# EAGLE schematic Seeeduino LoRaWan (EAGLE 7.6.0)
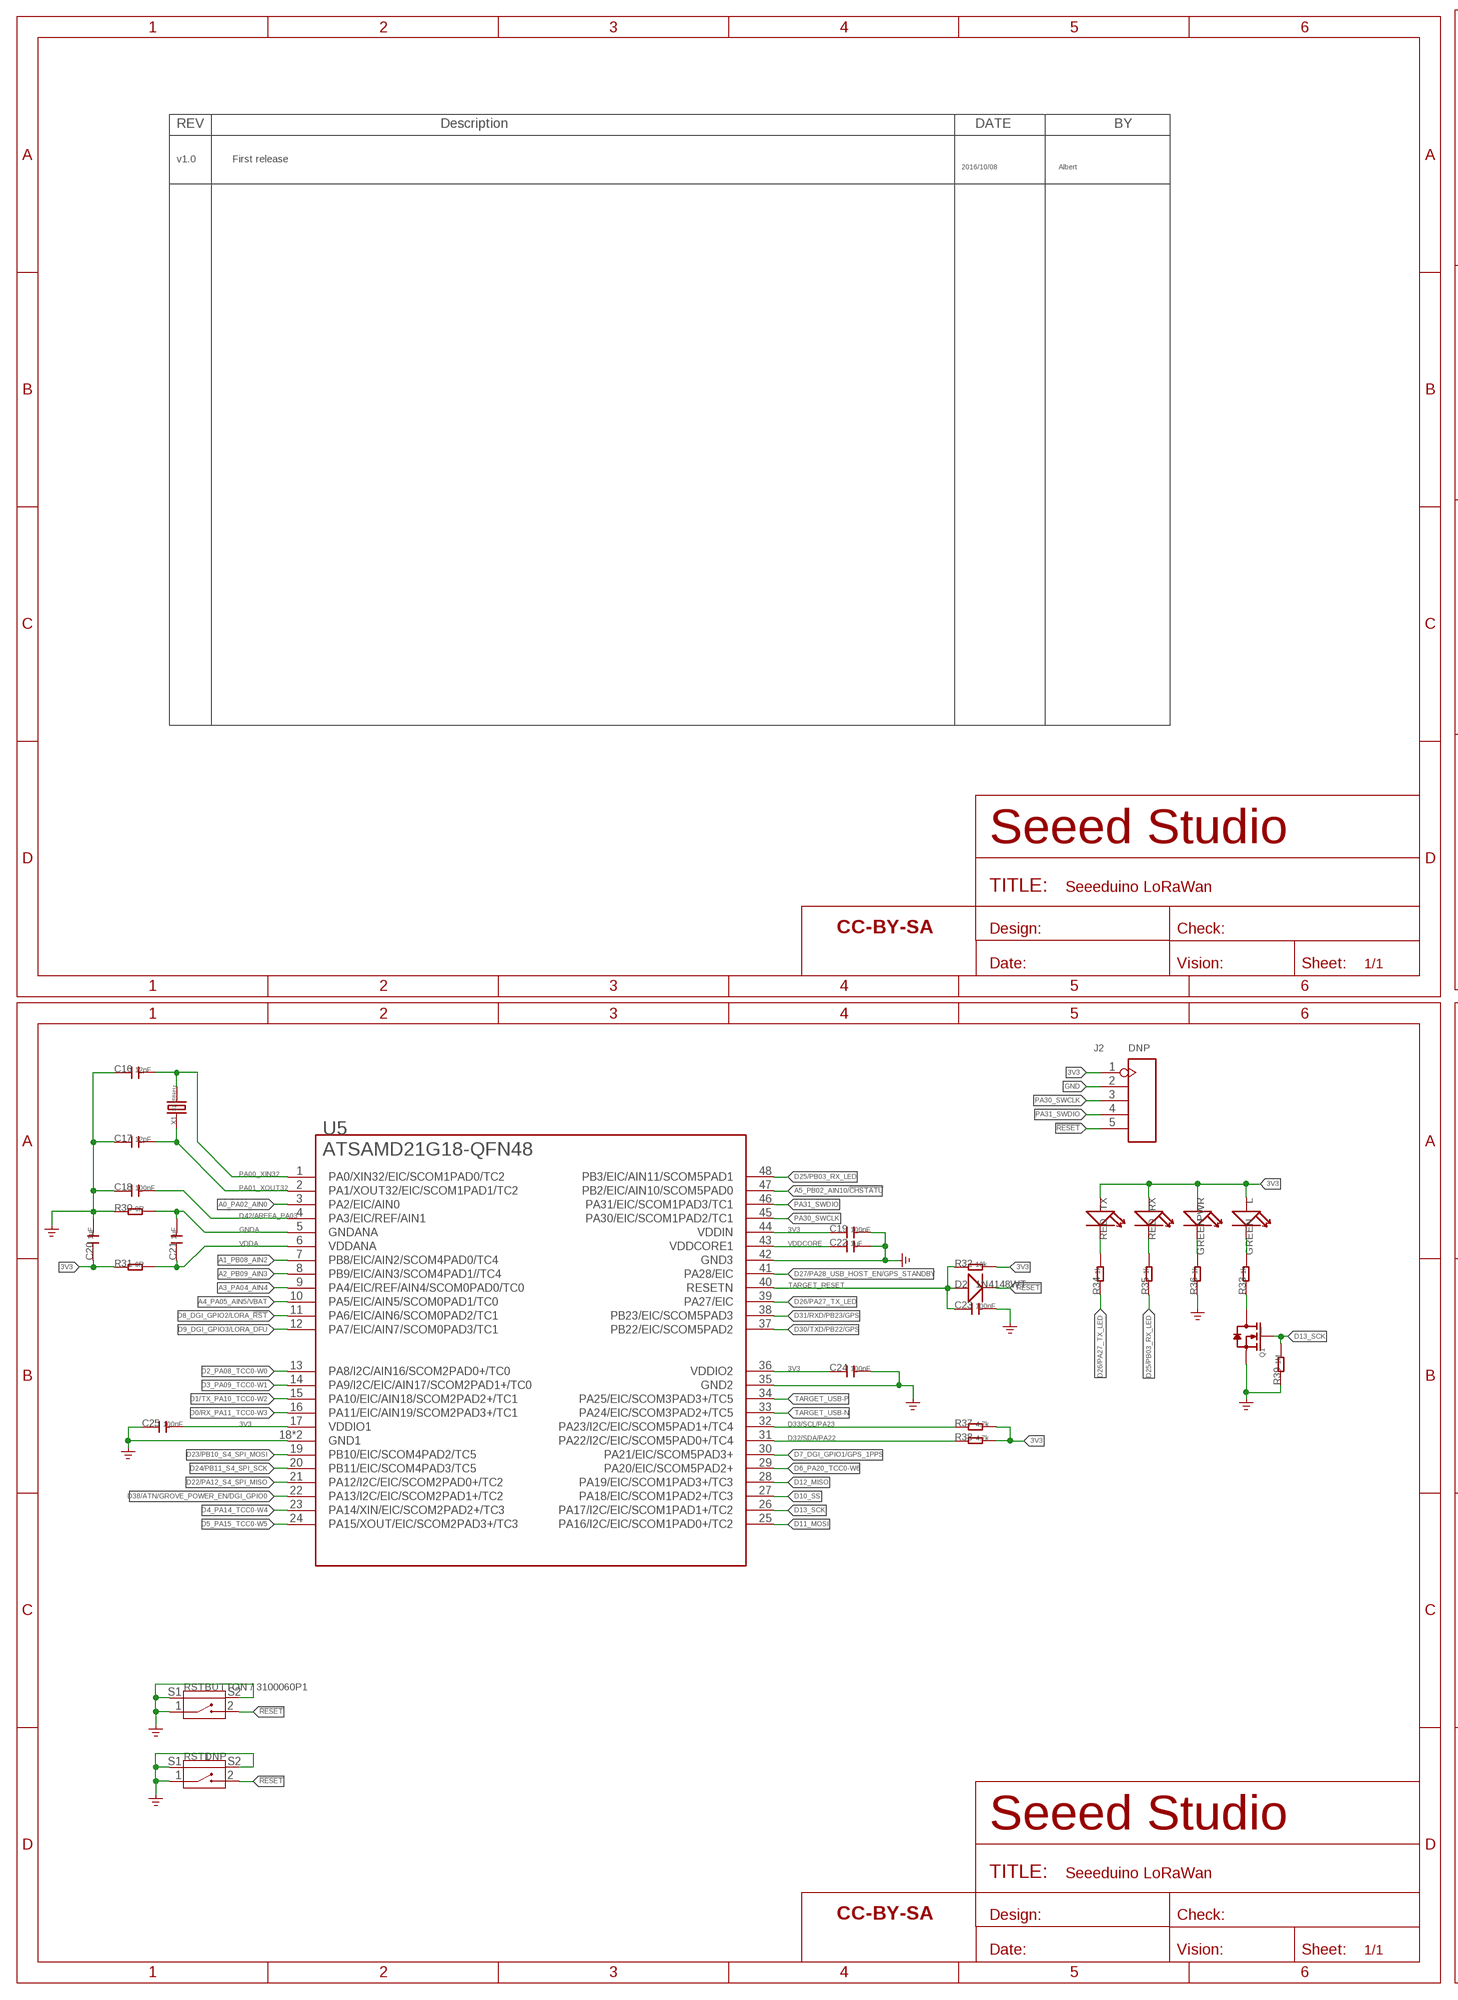
[diagram p0: schematic, sheet 1, part 1 of 2]
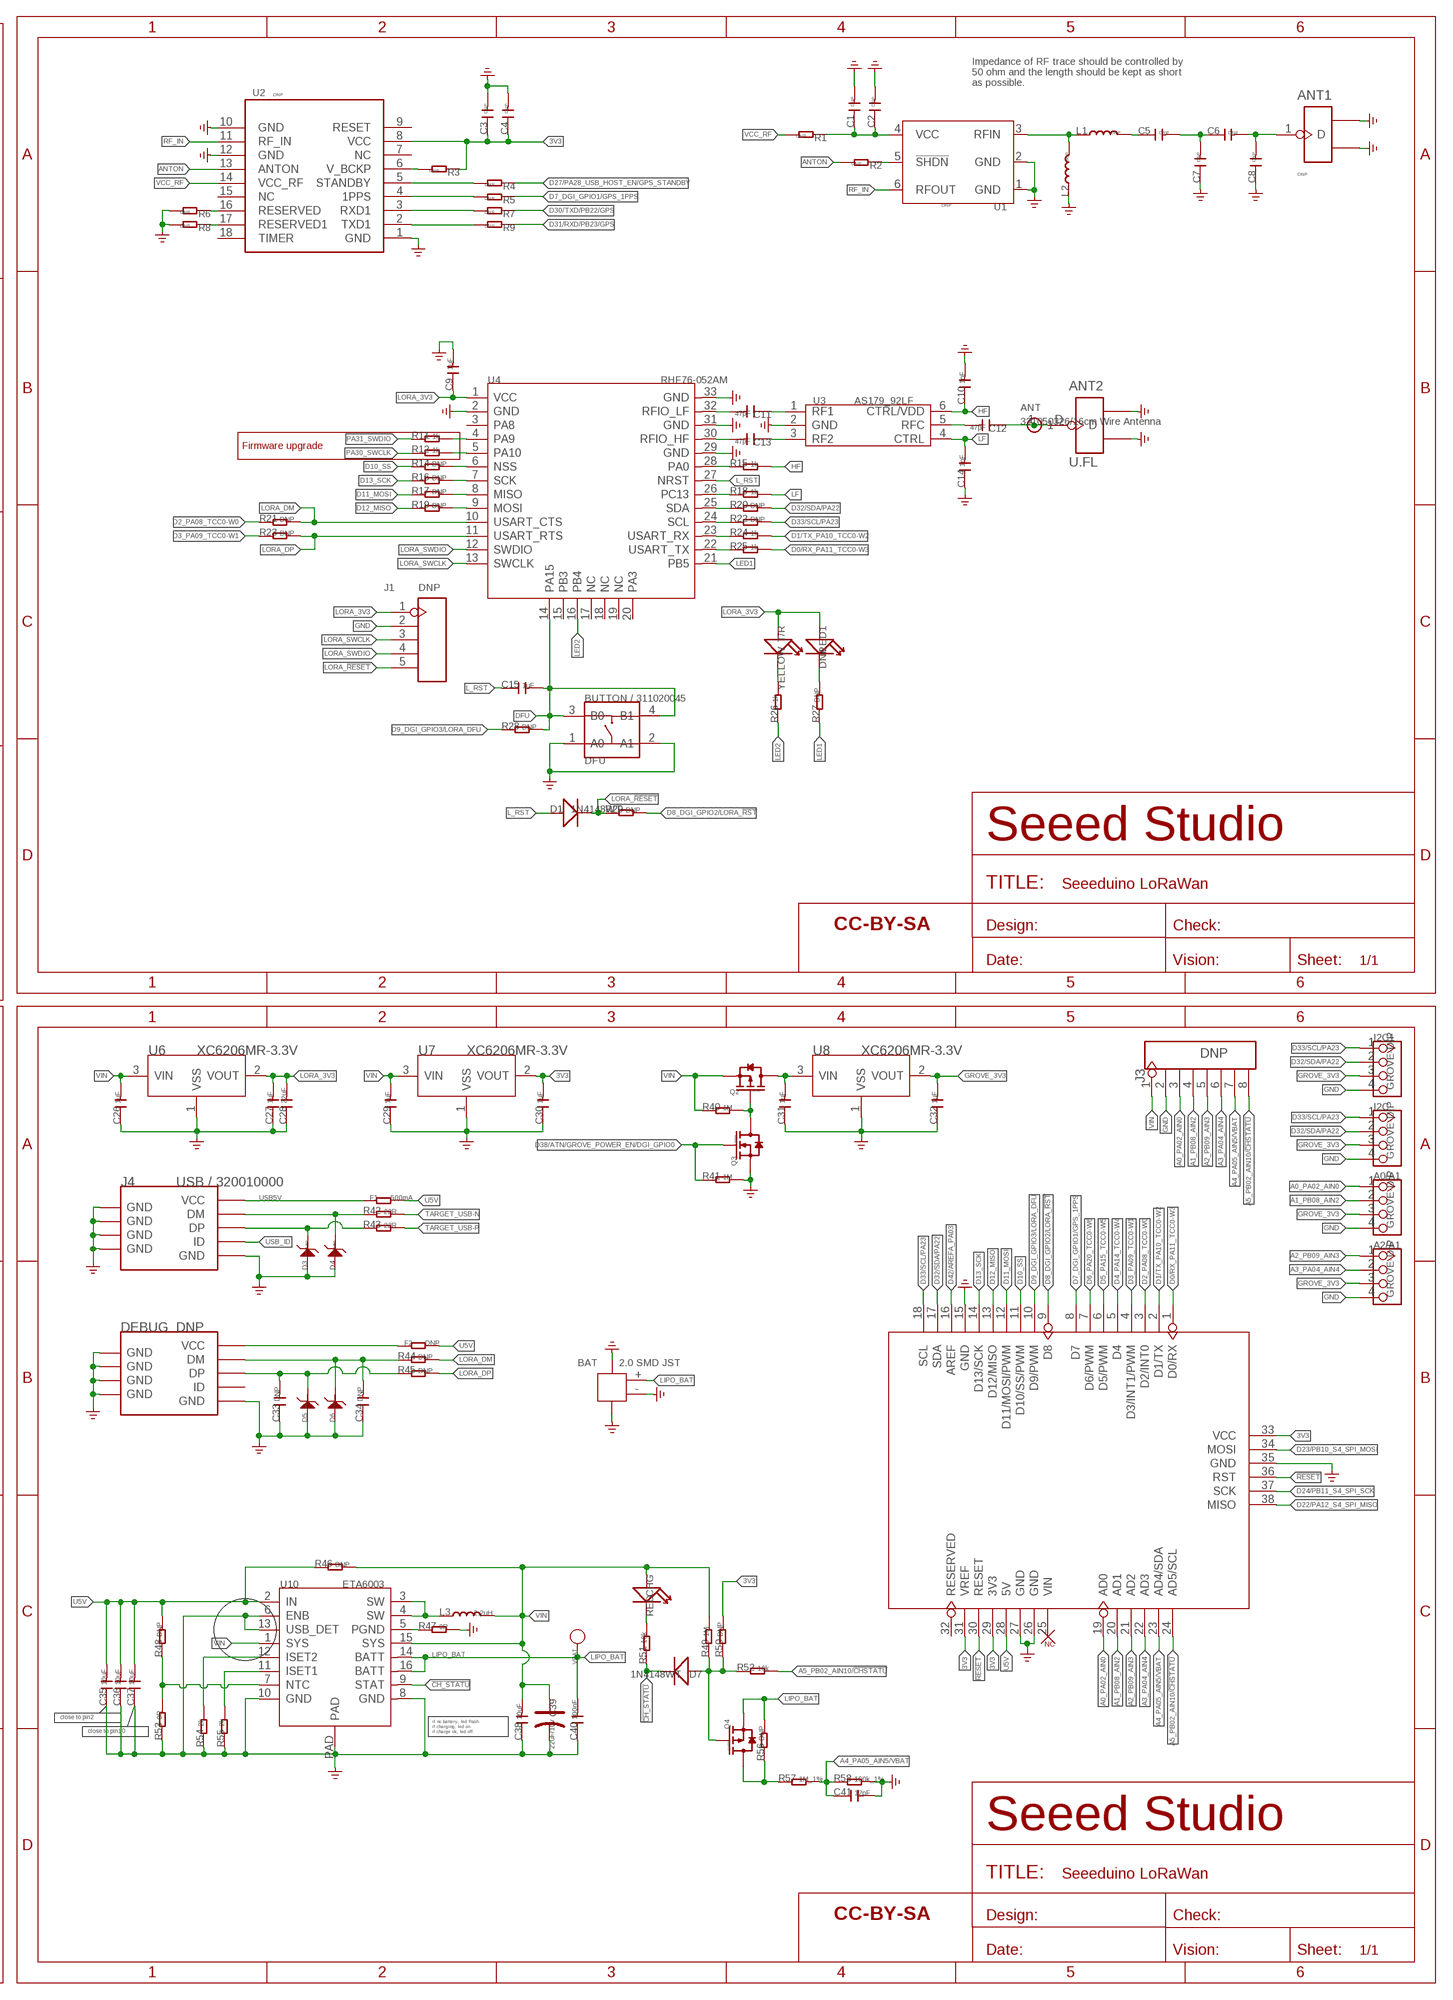
[diagram p1: schematic, sheet 1, part 2 of 2]

## Parts
A0/A1  GROVE-DIP  TWIG-4P-2.0-2.0  [4P-2.0]
A2/A1  GROVE-DIP  TWIG-4P-2.0-2.0  [4P-2.0]
ANT  321050326/16cm Wire Antenna  HEADER-1P-35  [1P-65/35MIL]
ANT1  DNP  ANTENNA-ACD5036  [ANT3-SMD-5.2X3.7X0.7MM]
ANT2  U.FL  ANTENNA-U-FL  [U-FL3P-SMD-2.6X2.6X1.0MM]
BAT  2.0 SMD JST  JST-2P-SMD'2.0'  [HW2-SMD-2.0-90D]
C1  DNP  C-0402  [C0402]
C2  DNP  C-0402  [C0402]
C3  DNP  C-0402  [C0402]
C4  DNP  C-0603  [C0603]
C5  DNP  C-0402  [C0402]
C6  DNP  C-0402  [C0402]
C7  DNP  C-0402  [C0402]
C8  DNP  C-0402  [C0402]
C9  1uF  C-0402  [C0402]
C10  1nF  C-0402  [C0402]
C11  47pF  C-0402  [C0402]
C12  47pF  C-0402  [C0402]
C13  47pF  C-0402  [C0402]
C14  1nF  C-0402  [C0402]
C15  1uF  C-0402  [C0402]
C16  12pF  C-0402  [C0402]
C17  12pF  C-0402  [C0402]
C18  100nF  C-0402  [C0402]
C19  100nF  C-0402  [C0402]
C20  1uF  C-0402  [C0402]
C21  1uF  C-0402  [C0402]
C22  1uF  C-0402  [C0402]
C23  100nF  C-0402  [C0402]
C24  100nF  C-0402  [C0402]
C25  100nF  C-0402  [C0402]
C26  1uF  C-0402  [C0402]
C27  1uF  C-0402  [C0402]
C28  22uF  C-0603  [C0603]
C29  1uF  C-0402  [C0402]
C30  1uF  C-0402  [C0402]
C31  1uF  C-0402  [C0402]
C32  1uF  C-0402  [C0402]
C33  DNP  C-0402  [C0402]
C34  DNP  C-0402  [C0402]
C35  10uF  C-0603  [C0603]
C36  10uF  C-0603  [C0603]
C37  10uF  C-0603  [C0603]
C38  10uF  C-0603  [C0603]
C39  22uF/10v  CAP-AVX-A  [AVX-A]
C40  100nF  C-0402  [C0402]
C41  12pF  C-0402  [C0402]
CHG  RED  LED'0603'  [LED-0603]
D1  1N4148WT  D'0603'  [SOD523]
D2  1N4148WT  D'0603'  [SOD523]
D3  DF2S6.8FS  D-ESD-2P'DF2S6.8FS'  [SOD-923]
D4  DF2S6.8FS  D-ESD-2P'DF2S6.8FS'  [SOD-923]
D5  DNP  D-ESD-2P'DF2S6.8FS'  [SOD-923]
D6  DNP  D-ESD-2P'DF2S6.8FS'  [SOD-923]
D7  1N4148WT  D'0603'  [SOD523]
DEBUG  DNP  USB-MINIUSB-5P-MICRO  [MICRO-USB]
DFU  BUTTON / 311020045  BUTTON-4P-4.5X3.2  [SW4P-SMD-4.5X3.2X2.5MM]
F1  500mA  R-0805  [R0805]
F2  DNP  R-0805  [R0805]
FR  PAGE1  SEEEDSTUDIO-OPEN-SCH-FRAME  [SEEEDSTUDIO-PCB-FRAME]
FR1  PAGE1  SEEEDSTUDIO-OPEN-SCH-FRAME  [SEEEDSTUDIO-PCB-FRAME]
I2C  GROVE-DIP  TWIG-4P-2.0-2.0  [4P-2.0]
I2C1  GROVE-DIP  TWIG-4P-2.0-2.0  [4P-2.0]
J1  DNP  HEADER-5P'TEST'  [H5-SMD-2.0-TEST]
J2  DNP  HEADER-5P'TEST'  [H5-SMD-2.0-TEST]
J3  DNP  HEADER-8P-65/35MIL  [8P-2.54-65/35MIL]
J4  USB / 320010000  USB-MINIUSB-5P-MICRO  [MICRO-USB]
L  GREEN  LED'0603'  [LED-0603]
L1  DNP  L'0402'  [L0402]
L2  DNP  L'0402'  [L0402]
L3  2.2uH  L'0805'  [L0805]
LED1  DNP  LED'0603'  [LED-0603]
PWR  GREEN  LED'0603'  [LED-0603]
Q1  CJ2102  MOSFET-N'SI1304BDL'  [SOT-323]
Q2  CJ2101  MOSFET-P-SOT323  [SOT323]
Q3  CJ2102  MOSFET-N'SI1304BDL'  [SOT-323]
Q4  CJ2101  MOSFET-P-SOT323  [SOT323]
R1  DNP  R-0402  [R0402]
R2  DNP  R-0402  [R0402]
R3  DNP  R-0402  [R0402]
R4  DNP  R-0402  [R0402]
R5  DNP  R-0402  [R0402]
R6  DNP  R-0402  [R0402]
R7  DNP  R-0402  [R0402]
R8  DNP  R-0402  [R0402]
R9  DNP  R-0402  [R0402]
R11  1k  R-0402  [R0402]
R12  1k  R-0402  [R0402]
R14  DNP  R-0402  [R0402]
R15  1k  R-0402  [R0402]
R16  DNP  R-0402  [R0402]
R17  DNP  R-0402  [R0402]
R18  1k  R-0402  [R0402]
R19  DNP  R-0402  [R0402]
R20  DNP  R-0402  [R0402]
R21  DNP  R-0402  [R0402]
R22  DNP  R-0402  [R0402]
R23  DNP  R-0402  [R0402]
R24  1k  R-0402  [R0402]
R25  1k  R-0402  [R0402]
R26  1k  R-0402  [R0402]
R27  DNP  R-0402  [R0402]
R28  DNP  R-0402  [R0402]
R29  DNP  R-0402  [R0402]
R30  0R  R-0402  [R0402]
R31  0R  R-0402  [R0402]
R32  10k  R-0402  [R0402]
R33  1k  R-0402  [R0402]
R34  1k  R-0402  [R0402]
R35  1k  R-0402  [R0402]
R36  1k  R-0402  [R0402]
R37  4.7k  R-0402  [R0402]
R38  4.7k  R-0402  [R0402]
R39  1M  R-0402  [R0402]
R40  1M  R-0402  [R0402]
R41  1M  R-0402  [R0402]
R42  22R  R-0402  [R0402]
R43  22R  R-0402  [R0402]
R44  DNP  R-0402  [R0402]
R45  DNP  R-0402  [R0402]
R46  DNP  R-0402  [R0402]
R47  0R  R-0402  [R0402]
R48  DNP  R-0402  [R0402]
R49  1M  R-0402  [R0402]
R50  DNP  R-0402  [R0402]
R51  10k  R-0402  [R0402]
R52  10k  R-0402  [R0402]
R53  0R  R-0402  [R0402]
R54  2k  R-0402  [R0402]
R55  2k  R-0402  [R0402]
R56  DNP  R-0402  [R0402]
R57  1M_1%  R-0402  [R0402]
R58  100k_1%  R-0402  [R0402]
RST  BUTTON / 3100060P1  BUTTON-2P-REINFORCE-3100060P1  [4P-SMD-7.0X3.5X3.5H-90D]
RST1  DNP  BUTTON-2P-REINFORCE-3100060P1  [4P-SMD-7.0X3.5X3.5H-90D]
RX  RED  LED'0603'  [LED-0603]
T/R  YELLOW  LED'0603'  [LED-0603]
TX  RED  LED'0603'  [LED-0603]
U1  DNP  AMPLIFIER-MAX2659  [DFN6-0.5-1.5X1.2X0.72MM]
U2  DNP  MOUDLE-GPS-L70-HARDWARE  [LGA18-1.1-9.7X10.1X2.5MM]
U3  AS179_92LF  PE4259  [SC-70]
U4  RHF76-052AM  MODULE-LORAWAN-RHF76-052  [MODULE33P-SMD-2.0-28X23X2.9MM]
U5  ATSAMD21G18-QFN48  [QFN48-7X7]
U6  XC6206MR-3.3V  XC6206MR  [SOT23]
U7  XC6206MR-3.3V  XC6206MR  [SOT23]
U8  XC6206MR-3.3V  XC6206MR  [SOT23]
U9  ARDUINO-38P  [ARDUINO-38P]
U10  ETA6003  PMIC-ETA6003  [QFN16G-0.5-3X3MM]
U$2  SEEEDSTUDIO-OPEN-SCH-FRAME  [SEEEDSTUDIO-PCB-FRAME]
U$3  SEEEDSTUDIO-OPEN-SCH-FRAME  [SEEEDSTUDIO-PCB-FRAME]
VBAT  DNP  PAD-TEST-POINT'4545'  [TP_4545]
X1  32.768kHz  CRYSTAL-2P-3215  [X2-SMD-3.2X1.5X0.55MM]

## Nets
3V3: C3.1 C4.1 C19.1 C20.1 C24.1 C25.2 C30.2 J2.1 L.+ PWR.+ R3.1 R31.1 R32.2 R37.2 R38.2 R50.2 RX.+ TX.+ U2.8(VCC) U5.17(VDDIO1) U5.36(VDDIO2) U5.44(VDDIN) U7.2(VOUT) U9.29(3V3) U9.31(VREF) U9.33(VCC)
!CH_STATU: D7.- R51.1 U10.9(STAT)
!RESET: D2.- J2.5 RST1.2 RST.2 U9.30(RESET) U9.36(RST)
A0_PA02_AIN0: A0/A1.1 J3.3 U5.3(PA2/EIC/AIN0) U9.19(AD0)
A1_PB08_AIN2: A0/A1.2 J3.4 U5.7(PB8/EIC/AIN2/SCOM4PAD0/TC4) U9.20(AD1)
A2_PB09_AIN3: A2/A1.1 J3.5 U5.8(PB9/EIC/AIN3/SCOM4PAD1//TC4) U9.21(AD2)
A3_PA04_AIN4: A2/A1.2 J3.6 U5.9(PA4/EIC/REF/AIN4/SCOM0PAD0/TC0) U9.22(AD3)
A4_PA05_AIN5/VBAT: C41.1 J3.7 R57.2 R58.1 U5.10(PA5/EIC/AIN5/SCOM0PAD1/TC0) U9.23(AD4/SDA)
A5_PB02_AIN10/!CHSTATU: J3.8 R52.2 U5.47(PB2/EIC/AIN10/SCOM5PAD0) U9.24(AD5/SCL)
ANTON: R2.2 U2.13(ANTON)
D0/RX_PA11_TCC0-W3: R25.2 U5.16(PA11/EIC/AIN19/SCOM2PAD3+/TC1) U9.1(D0/RX)
D1/TX_PA10_TCC0-W2: R24.2 U5.15(PA10/EIC/AIN18/SCOM2PAD2+/TC1) U9.2(D1/TX)
D2_PA08_TCC0-W0: R21.1 U5.13(PA8/I2C/AIN16/SCOM2PAD0+/TC0) U9.3(D2/INT0)
D3_PA09_TCC0-W1: R23.1 U5.14(PA9/I2C/EIC/AIN17/SCOM2PAD1+/TC0) U9.4(D3/INT1/PWM)
D4_PA14_TCC0-W4: U5.23(PA14/XIN/EIC/SCOM2PAD2+/TC3) U9.5(D4)
D5_PA15_TCC0-W5: U5.24(PA15/XOUT/EIC/SCOM2PAD3+/TC3) U9.6(D5/PWM)
D6_PA20_TCC0-W6: U5.29(PA20/EIC/SCOM5PAD2+) U9.7(D6/PWM)
D7_DGI_GPIO1/GPS_1PPS: R5.1 U5.30(PA21/EIC/SCOM5PAD3+) U9.8(D7)
D8_DGI_GPIO2/LORA_!RST: R29.2 U5.11(PA6/EIC/AIN6/SCOM0PAD2/TC1) U9.9(D8)
D9_DGI_GPIO3/LORA_DFU: R28.1 U5.12(PA7/EIC/AIN7/SCOM0PAD3/TC1) U9.10(D9/PWM)
D10_SS: R14.1 U5.27(PA18/EIC/SCOM1PAD2+/TC3) U9.11(D10/SS/PWM)
D11_MOSI: R17.1 U5.25(PA16/I2C/EIC/SCOM1PAD0+/TC2) U9.12(D11/MOSI/PWM)
D12_MISO: R19.1 U5.28(PA19/EIC/SCOM1PAD3+/TC3) U9.13(D12/MISO)
D13_SCK: Q1.1(G) R16.1 R39.2 U5.26(PA17/I2C/EIC/SCOM1PAD1+/TC2) U9.14(D13/SCK)
D22/PA12_S4_SPI_MISO: U5.21(PA12/I2C/EIC/SCOM2PAD0+/TC2) U9.38(MISO)
D23/PB10_S4_SPI_MOSI: U5.19(PB10/EIC/SCOM4PAD2/TC5) U9.34(MOSI)
D24/PB11_S4_SPI_SCK: U5.20(PB11/EIC/SCOM4PAD3/TC5) U9.37(SCK)
D25/PB03_RX_LED: R35.1 U5.48(PB3/EIC/AIN11/SCOM5PAD1)
D26/PA27_TX_LED: R34.1 U5.39(PA27/EIC)
D27/PA28_USB_HOST_EN/GPS_STANDBY: R4.1 U5.41(PA28/EIC)
D30/TXD/PB22/GPS: R7.1 U5.37(PB22/EIC/SCOM5PAD2)
D31/RXD/PB23/GPS: R9.1 U5.38(PB23/EIC/SCOM5PAD3)
D32/SDA/PA22: I2C1.2 I2C.2 R20.2 R38.1 U5.31(PA22/I2C/EIC/SCOM5PAD0+/TC4) U9.17(SDA)
D33/SCL/PA23: I2C1.1 I2C.1 R22.2 R37.1 U5.32(PA23/I2C/EIC/SCOM5PAD1+/TC4) U9.18(SCL)
D38/ATN/GROVE_POWER_EN/DGI_GPIO0: Q3.1(G) R41.1 U5.22(PA13/I2C/EIC/SCOM2PAD1+/TC2)
D42/AREFA_PA03: C18.2 U5.4(PA3/EIC/REF/AIN1) U9.16(AREF)
DFU: C15.2 DFU.3(B0) DFU.4(B1) R28.2 U4.14(PA15)
GND: A0/A1.4 A2/A1.4 ANT1.2(GND1) ANT1.3(GND2) ANT2.GND1 ANT2.GND2 BAT.3 BAT.4 BAT.- C1.2 C2.2 C3.2 C4.2 C7.1 C8.1 C9.2 C10.2 C14.1 C16.1 C17.1 C18.1 C19.2 C20.2 C22.2 C23.2 C24.2 C25.1 C26.1 C27.1 C28.1 C29.1 C30.1 C31.1 C32.1 C33.1 C34.1 C35.1 C36.1 C37.1 C38.1 C39.- C40.1 C41.2 D3.2 D4.2 D5.2 D6.2 DEBUG.5(GND) DEBUG.S1(GND) DEBUG.S2(GND) DEBUG.S3(GND) DEBUG.S4(GND) DEBUG.S5(GND) DEBUG.S6(GND) DFU.1(A0) DFU.2(A1) I2C1.4 I2C.4 J1.2 J2.2 J3.2 J4.5(GND) J4.S1(GND) J4.S2(GND) J4.S3(GND) J4.S4(GND) J4.S5(GND) J4.S6(GND) L2.1 Q1.2(S) Q3.2(S) R6.2 R8.2 R30.1 R36.1 R39.1 R41.2 R47.2 R53.1 R54.1 R55.1 R58.2 RST1.1 RST1.S1 RST1.S2 RST.1 RST.S1 RST.S2 U1.1(GND) U1.2(GND) U2.1(GND) U2.10(GND) U2.12(GND) U3.2(GND) U4.2(GND) U4.29(GND) U4.31(GND) U4.33(GND) U5.18(GND1) U5.35(GND2) U5.42(GND3) U5.PAD(GND1) U6.1(VSS) U7.1(VSS) U8.1(VSS) U9.15(GND) U9.26(GND) U9.27(GND) U9.35(GND) U10.6(ENB) U10.8(GND) U10.10(GND) U10.13(USB_DET) U10.PAD ; supply symbol labelled GND_POWER
GNDA: C21.2 R30.2 U5.5(GNDANA)
GROVE_3V3: A0/A1.3 A2/A1.3 C32.2 I2C1.3 I2C.3 U8.2(VOUT)
HF: C10.1 R15.2 U3.6(!CTRL!/VDD)
L_RST: C15.1 D1.+ U4.27(NRST)
LED1: R27.1 U4.21(PB5)
LED2: R26.1 U4.16(PB4)
LF: C14.2 R18.2 U3.4(CTRL)
LIPO_BAT: BAT.+ C40.2 Q4.2(S) R56.2 U10.14(BATT) U10.16(BATT) VBAT.T
LORA_3V3: C9.1 C27.2 C28.2 J1.1 LED1.+ T/R.+ U4.1(VCC) U6.2(VOUT)
LORA_!RESET: D1.- J1.5 R29.1
LORA_DM: R21.2 R44.2 U4.10(USART_CTS)
LORA_DP: R23.2 R45.2 U4.11(USART_RTS)
LORA_SWCLK: J1.3 U4.13(SWCLK)
LORA_SWDIO: J1.4 U4.12(SWDIO)
N$1: Q1.3(D) R33.1
N$2: R34.2 TX.-
N$3: C5.2 C6.1 C7.2
N$4: R35.2 RX.-
N$5: L.- R33.2
N$6: ANT1.1(D) C6.2 C8.2
N$7: D3.1 J4.3(DP) R43.1
N$8: L1.1 L2.2 U1.3(RFIN)
N$9: C33.2 D5.1 DEBUG.3(DP) R45.1
N$10: D4.1 J4.2(DM) R42.1
N$11: C5.1 L1.2
N$12: PWR.- R36.2
N$13: R2.1 U1.5(!SHDN)
N$14: C1.1 C2.1 R1.1 U1.4(VCC)
N$15: DEBUG.1(VCC) F2.1
N$16: R6.1 U2.16(RESERVED)
N$17: R8.1 U2.17(RESERVED1)
N$18: R3.2 U2.6(V_BCKP)
N$19: R4.2 U2.5(STANDBY)
N$20: R5.2 U2.4(1PPS)
N$21: R48.1 R53.2 U10.7(NTC)
N$22: R55.2 U10.11(ISET1)
N$25: C34.2 D6.1 DEBUG.2(DM) R44.1
N$26: C12.2 U3.5(RFC)
N$27: C11.2 U4.32(RFIO_LF)
N$28: C13.2 U4.30(RFIO_HF)
N$31: R54.2 U10.12(ISET2)
N$32: R24.1 U4.23(USART_RX)
N$33: R47.1 U10.5(PGND)
N$34: R25.1 U4.22(USART_TX)
N$35: R11.2 U4.4(PA9)
N$36: R12.2 U4.5(PA10)
N$37: CHG.- R51.2
N$38: Q4.3(D) R56.1 R57.1
N$39: R20.1 U4.25(SDA)
N$40: R22.1 U4.24(SCL)
N$41: R19.2 U4.9(MOSI)
N$42: R17.2 U4.8(MISO)
N$43: R16.2 U4.7(SCK)
N$44: R14.2 U4.6(NSS)
N$45: C31.2 Q2.3(D) U8.3(VIN)
N$46: R26.2 T/R.-
N$48: LED1.- R27.2
N$51: R15.1 U4.28(PA0)
N$52: R18.1 U4.26(PC13)
N$53: Q2.1(G) Q3.3(D) R40.2
N$54: D7.+ Q4.1(G) R49.1 R50.1 R52.1
N$55: C11.1 U3.1(RF1)
N$56: C13.1 U3.3(RF2)
N$57: ANT2.D ANT.1 C12.1
N$84: L3.1 U10.3(SW) U10.4(SW)
PA00_XIN32: C16.2 U5.1(PA0/XIN32/EIC/SCOM1PAD0/TC2) X1.2
PA01_XOUT32: C17.2 U5.2(PA1/XOUT32/EIC/SCOM1PAD1/TC2) X1.1
PA30_SWCLK: J2.3 R12.1 U5.45(PA30/EIC/SCOM1PAD2/TC1)
PA31_SWDIO: J2.4 R11.1 U5.46(PA31/EIC/SCOM1PAD3/TC1)
RF_IN: U1.6(RFOUT) U2.11(RF_IN)
RXD1: R7.2 U2.3(RXD1)
TARGET_RESET: C23.1 D2.+ R32.1 U5.40(RESETN)
TARGET_USB-N: R42.2 U5.33(PA24/EIC/SCOM3PAD2+/TC5)
TARGET_USB-P: R43.2 U5.34(PA25/EIC/SCOM3PAD3+/TC5)
TXD1: R9.2 U2.2(TXD1)
U5V: C35.2 C36.2 C37.2 F1.2 F2.2 R46.1 R48.2 U9.28(5V) U10.2(IN)
USB5V: F1.1 J4.1(VCC)
USB_ID: J4.4(ID)
VCC_RF: R1.2 U2.14(VCC_RF)
VDDA: C21.1 R31.2 U5.6(VDDANA)
VDDCORE: C22.1 U5.43(VDDCORE1)
VIN: C26.2 C29.2 C38.2 C39.+ CHG.+ J3.1 L3.2 Q2.2(S) R40.1 R46.2 R49.2 U6.3(VIN) U7.3(VIN) U10.1(SYS) U10.15(SYS)
Unconnected: DEBUG.4(ID) U2.7(NC) U2.9(RESET) U2.15(NC) U2.18(TIMER) U4.3(PA8) U4.15(PB3) U4.17(NC) U4.18(NC) U4.19(NC) U4.20(PA3) U9.25(VIN) U9.32(RESERVED)

## Notes on the sheet
- Impedance of RF trace should be controlled by 
  50 ohm and the length should be kept as short 
  as possible.
- v1.0 | First release
- 2016/10/08 | Albert
- Firmware upgrade
- NC
- close to pin2
- close to pin10
- if no battery, led flash.
  if charging, led on.
  if charge ok, led off.

## Library data of the parts
A0/A1 A2/A1 I2C I2C1 = Connector:TWIG-4P-2.0
ANT = Connector:HEADER-1P
ANT1 = AMLib_New:ANTENNA-ACD5036; MPN: ACD-5036-A3-CC-S
ANT2 = Connector-update:ANTENNA-U-FL: 320110048
BAT = Connector-update:JST-2P-SMD: 2P-SMD-1.0-90D:320110054;2P-SMD-2.0-90D:320110026
C1-C38 C40 C41 = Discrete:C*: Ceramic Capacitors
C39 = Discrete-smallsmall:CAP*: Electrolytic Capacitors,Tantalum Capacitors and Super Capacitors
CHG L LED1 PWR RX T/R TX = Discrete:LED*
D1 D2 D7 = Discrete:D*
D3-D6 = Discrete-new:D-ESD-2P: SOD-923:304060009;SOD-123:304060001
DEBUG J4 = Connector:USB-MINIUSB-5P
DFU = Discrete-new:BUTTON-4P: SW4-6.0X6.0X5.0MM:311020024;SW4-8.0X8.0X9.0MM:311020028;SW4-SMD-6.0X6.0X5.0MM:311020004;SW4-SMD-3.35X3.35X1.5MM:311020030;SW4-SMD-5.2X5.2X2.5MM:311020046
F1 F2 = Discrete-smallsmall:R*
FR FR1 U$2 U$3 = moudle-new:SEEEDSTUDIO-OPEN-SCH-FRAME
J1 J2 = Connector-new:HEADER-5P
J3 = Connector:HEADER-8P
L1-L3 = Discrete:L*
Q1 Q3 = Discrete-new:MOSFET-N
Q2 Q4 = Discrete:MOSFET-P
R1-R9 R11 R12 R14-R58 = Discrete:R*
RST RST1 = Discrete:BUTTON-2P-REINFORCE: TS-1188E http://www.best-dz.com/?thread-374-2.html SMD Button
U1 = AMLib_New:AMPLIFIER-MAX2659: GPS/GNSS Low-Noise Amplifier; MPN: MAX2659; VALUE: MAX2659-DFN6
U2 = moudle-new:MOUDLE-GPS-L70-HARDWARE: L70 GPS module; MPN: L70; VALUE: L70
U3 = AMLib_New:PE4259
U4 = LoraWan:MODULE-LORAWAN-RHF76-052
U5 = AMLib_New:ATSAMD21G18: Atmel D21 32bit ARM Cortex-M0 microcontroller - 48 PIN TQFP 256KB flash memory + 32KB SRAM
U6-U8 = IC:XC6206: LOW ESR Cap.Compatible Positive Voltage Regulators
U9 = moudle:ARDUINO-38P
U10 = AMLib_New:PMIC-ETA6003: 2.5A,3MHZ Switching Charger with Dynamic Power Path Management
VBAT = Discrete:PAD-TEST-POINT; PARTNO: DNP
X1 = Discrete-new:CRYSTAL-2P

## Net classes
0 default: width 0.025 mm, drill 0.203 mm, clearance 0.127 mm